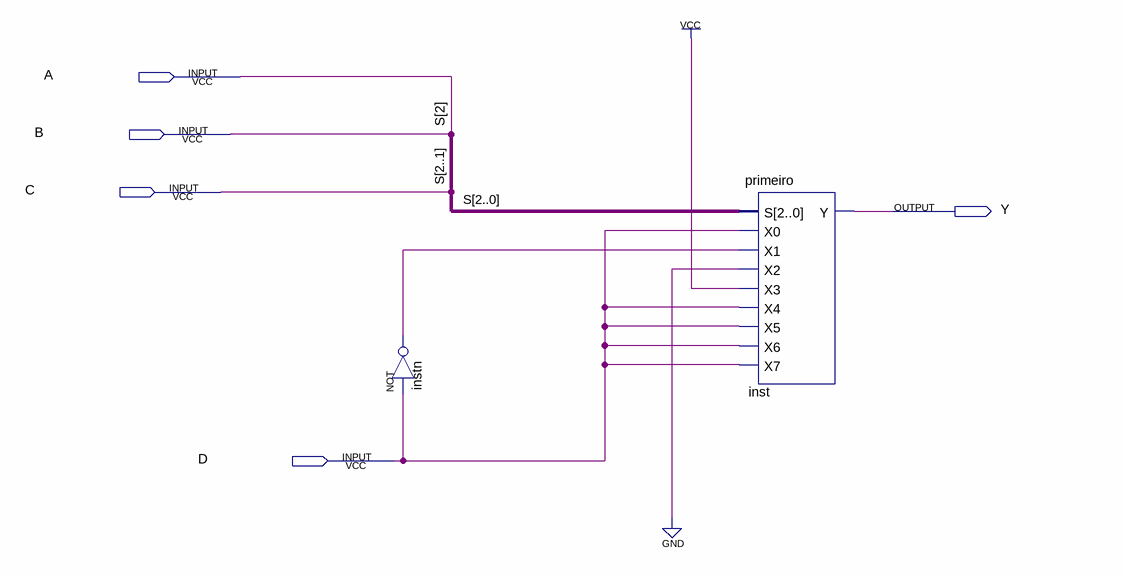
[diagram p0: schematic sheet]
// Quartus schematic terceiroex.bdf as structural Verilog: 2 symbols, 5 pins
module terceiroex (
  input  A,
  input  B,
  input  C,
  input  D,
  output Y
);

  wire instn_out;
  wire [1:0] S;

  not instn (instn_out, D);
  primeiro inst (.S({A, S}), .X0(D), .X1(instn_out), .X2(1'b0), .X3(1'b1), .X4(D), .X5(D), .X6(D), .X7(D), .Y(Y));

  // Other names for the same wires on the sheet: S[2] = A
endmodule
